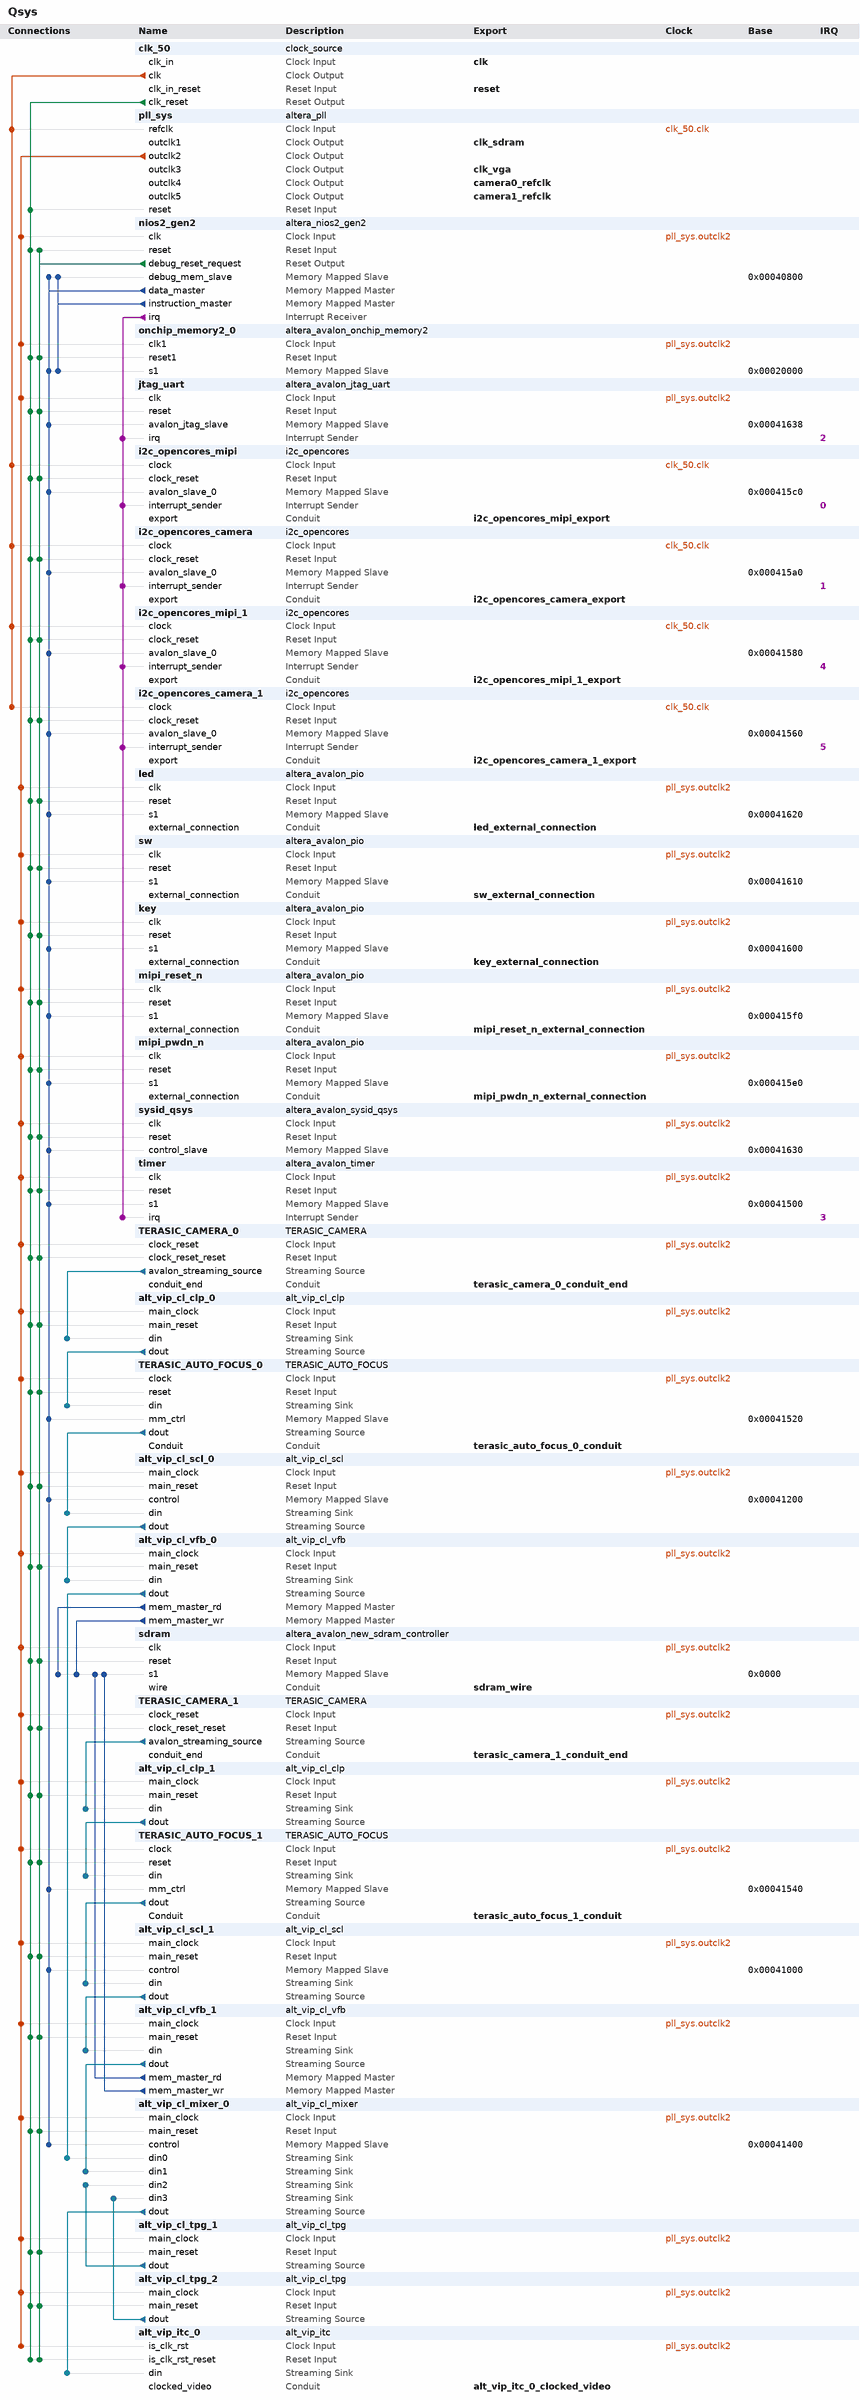
[diagram p0: system contents]
# Platform Designer (Qsys) system Qsys, Cyclone V 5CSEMA5F31C6
# Parameters at their usual value, and those the tool derives, are not listed.
package require -exact qsys 15.0
create_system Qsys
set_project_property DEVICE_FAMILY {Cyclone V}
set_project_property DEVICE 5CSEMA5F31C6

add_instance clk_50 clock_source 15.0
set_instance_parameter_value clk_50 clockFrequency 50000000

add_instance pll_sys altera_pll 15.0
set_instance_parameter_value pll_sys gui_device_speed_grade 2
set_instance_parameter_value pll_sys gui_number_of_clocks 6
set_instance_parameter_value pll_sys gui_operation_mode normal
set_instance_parameter_value pll_sys gui_output_clock_frequency0 100.0
set_instance_parameter_value pll_sys gui_output_clock_frequency1 100.0
set_instance_parameter_value pll_sys gui_output_clock_frequency2 100.0
set_instance_parameter_value pll_sys gui_output_clock_frequency3 40.0
set_instance_parameter_value pll_sys gui_phase_shift1 -3000
set_instance_parameter_value pll_sys gui_phase_shift_deg1 -90.0
set_instance_parameter_value pll_sys gui_pll_mode {Integer-N PLL}
set_instance_parameter_value pll_sys gui_reference_clock_frequency 50.0
set_instance_parameter_value pll_sys gui_use_locked false

add_instance nios2_gen2 altera_nios2_gen2 15.0
set_instance_parameter_value nios2_gen2 dcache_size 2048
set_instance_parameter_value nios2_gen2 exceptionSlave onchip_memory2_0.s1
set_instance_parameter_value nios2_gen2 icache_size 4096
set_instance_parameter_value nios2_gen2 impl Fast
set_instance_parameter_value nios2_gen2 resetSlave onchip_memory2_0.s1

add_instance onchip_memory2_0 altera_avalon_onchip_memory2 15.0
set_instance_parameter_value onchip_memory2_0 dataWidth 32
set_instance_parameter_value onchip_memory2_0 dualPort false
set_instance_parameter_value onchip_memory2_0 initMemContent false
set_instance_parameter_value onchip_memory2_0 initializationFileName onchip_mem.hex
set_instance_parameter_value onchip_memory2_0 memorySize 131072

add_instance jtag_uart altera_avalon_jtag_uart 15.0
set_instance_parameter_value jtag_uart simInteractiveOptions NO_INTERACTIVE_WINDOWS

add_instance i2c_opencores_mipi i2c_opencores 12.0

add_instance i2c_opencores_camera i2c_opencores 12.0

add_instance i2c_opencores_mipi_1 i2c_opencores 12.0

add_instance i2c_opencores_camera_1 i2c_opencores 12.0

add_instance led altera_avalon_pio 15.0
set_instance_parameter_value led direction Output
set_instance_parameter_value led width 10

add_instance sw altera_avalon_pio 15.0
set_instance_parameter_value sw direction Input
set_instance_parameter_value sw width 10

add_instance key altera_avalon_pio 15.0
set_instance_parameter_value key direction Input
set_instance_parameter_value key width 4

add_instance mipi_reset_n altera_avalon_pio 15.0
set_instance_parameter_value mipi_reset_n direction Output
set_instance_parameter_value mipi_reset_n width 1

add_instance mipi_pwdn_n altera_avalon_pio 15.0
set_instance_parameter_value mipi_pwdn_n direction Output
set_instance_parameter_value mipi_pwdn_n width 1

add_instance sysid_qsys altera_avalon_sysid_qsys 15.0
set_instance_parameter_value sysid_qsys id 0

add_instance timer altera_avalon_timer 15.0
set_instance_parameter_value timer period 1
set_instance_parameter_value timer periodUnits MSEC

add_instance TERASIC_CAMERA_0 TERASIC_CAMERA 1.0

add_instance alt_vip_cl_clp_0 alt_vip_cl_clp 15.0
set_instance_parameter_value alt_vip_cl_clp_0 BITS_PER_SYMBOL 8
set_instance_parameter_value alt_vip_cl_clp_0 BOTTOM_OFFSET 10
set_instance_parameter_value alt_vip_cl_clp_0 CLIPPING_METHOD RECTANGLE
set_instance_parameter_value alt_vip_cl_clp_0 COLOR_PLANES_ARE_IN_PARALLEL 1
set_instance_parameter_value alt_vip_cl_clp_0 FAMILY {Cyclone V}
set_instance_parameter_value alt_vip_cl_clp_0 LEFT_OFFSET 0
set_instance_parameter_value alt_vip_cl_clp_0 MAX_IN_HEIGHT 1080
set_instance_parameter_value alt_vip_cl_clp_0 MAX_IN_WIDTH 1920
set_instance_parameter_value alt_vip_cl_clp_0 NUMBER_OF_COLOR_PLANES 3
set_instance_parameter_value alt_vip_cl_clp_0 PIXELS_IN_PARALLEL 1
set_instance_parameter_value alt_vip_cl_clp_0 RECTANGLE_HEIGHT 480
set_instance_parameter_value alt_vip_cl_clp_0 RECTANGLE_WIDTH 640
set_instance_parameter_value alt_vip_cl_clp_0 RIGHT_OFFSET 10
set_instance_parameter_value alt_vip_cl_clp_0 RUNTIME_CONTROL 0
set_instance_parameter_value alt_vip_cl_clp_0 TOP_OFFSET 0

add_instance TERASIC_AUTO_FOCUS_0 TERASIC_AUTO_FOCUS 1.0

add_instance alt_vip_cl_scl_0 alt_vip_cl_scl 15.0
set_instance_parameter_value alt_vip_cl_scl_0 ALGORITHM_NAME POLYPHASE
set_instance_parameter_value alt_vip_cl_scl_0 ALWAYS_DOWNSCALE 0
set_instance_parameter_value alt_vip_cl_scl_0 ARE_IDENTICAL 0
set_instance_parameter_value alt_vip_cl_scl_0 BITS_PER_SYMBOL 8
set_instance_parameter_value alt_vip_cl_scl_0 DEFAULT_EDGE_THRESH 7
set_instance_parameter_value alt_vip_cl_scl_0 DEFAULT_LOWER_BLUR 0
set_instance_parameter_value alt_vip_cl_scl_0 DEFAULT_UPPER_BLUR 15
set_instance_parameter_value alt_vip_cl_scl_0 ENABLE_FIR 0
set_instance_parameter_value alt_vip_cl_scl_0 EXTRA_PIPELINING 0
set_instance_parameter_value alt_vip_cl_scl_0 FAMILY {Cyclone V}
set_instance_parameter_value alt_vip_cl_scl_0 H_BANKS 1
set_instance_parameter_value alt_vip_cl_scl_0 H_COEFF_FILE {<enter file name (including full path)>}
set_instance_parameter_value alt_vip_cl_scl_0 H_FRACTION_BITS 7
set_instance_parameter_value alt_vip_cl_scl_0 H_FUNCTION LANCZOS_2
set_instance_parameter_value alt_vip_cl_scl_0 H_INTEGER_BITS 1
set_instance_parameter_value alt_vip_cl_scl_0 H_PHASES 16
set_instance_parameter_value alt_vip_cl_scl_0 H_SIGNED 1
set_instance_parameter_value alt_vip_cl_scl_0 H_SYMMETRIC 0
set_instance_parameter_value alt_vip_cl_scl_0 H_TAPS 8
set_instance_parameter_value alt_vip_cl_scl_0 IS_420 0
set_instance_parameter_value alt_vip_cl_scl_0 IS_422 0
set_instance_parameter_value alt_vip_cl_scl_0 LOAD_AT_RUNTIME 0
set_instance_parameter_value alt_vip_cl_scl_0 MAX_IN_HEIGHT 480
set_instance_parameter_value alt_vip_cl_scl_0 MAX_IN_WIDTH 640
set_instance_parameter_value alt_vip_cl_scl_0 MAX_OUT_HEIGHT 480
set_instance_parameter_value alt_vip_cl_scl_0 MAX_OUT_WIDTH 640
set_instance_parameter_value alt_vip_cl_scl_0 NO_BLANKING 0
set_instance_parameter_value alt_vip_cl_scl_0 PRESERVE_BITS 0
set_instance_parameter_value alt_vip_cl_scl_0 RUNTIME_CONTROL 1
set_instance_parameter_value alt_vip_cl_scl_0 SYMBOLS_IN_PAR 3
set_instance_parameter_value alt_vip_cl_scl_0 SYMBOLS_IN_SEQ 1
set_instance_parameter_value alt_vip_cl_scl_0 V_BANKS 1
set_instance_parameter_value alt_vip_cl_scl_0 V_COEFF_FILE {<enter file name (including full path)>}
set_instance_parameter_value alt_vip_cl_scl_0 V_FRACTION_BITS 7
set_instance_parameter_value alt_vip_cl_scl_0 V_FUNCTION LANCZOS_2
set_instance_parameter_value alt_vip_cl_scl_0 V_INTEGER_BITS 1
set_instance_parameter_value alt_vip_cl_scl_0 V_PHASES 16
set_instance_parameter_value alt_vip_cl_scl_0 V_SIGNED 1
set_instance_parameter_value alt_vip_cl_scl_0 V_SYMMETRIC 0
set_instance_parameter_value alt_vip_cl_scl_0 V_TAPS 8

add_instance alt_vip_cl_vfb_0 alt_vip_cl_vfb 15.0
set_instance_parameter_value alt_vip_cl_vfb_0 CLOCKS_ARE_SEPARATE 0
set_instance_parameter_value alt_vip_cl_vfb_0 CORRECT_INVALID_FIELDS 0
set_instance_parameter_value alt_vip_cl_vfb_0 DROP_FRAMES 1
set_instance_parameter_value alt_vip_cl_vfb_0 IS_FRAME_READER 0
set_instance_parameter_value alt_vip_cl_vfb_0 MAX_HEIGHT 480
set_instance_parameter_value alt_vip_cl_vfb_0 MAX_WIDTH 640
set_instance_parameter_value alt_vip_cl_vfb_0 MEM_BASE_ADDR 0
set_instance_parameter_value alt_vip_cl_vfb_0 MEM_PORT_WIDTH 32
set_instance_parameter_value alt_vip_cl_vfb_0 READER_RUNTIME_CONTROL 0
set_instance_parameter_value alt_vip_cl_vfb_0 READ_FIFO_DEPTH 512
set_instance_parameter_value alt_vip_cl_vfb_0 USER_PACKETS_MAX_STORAGE 1
set_instance_parameter_value alt_vip_cl_vfb_0 WRITE_BURST_TARGET 32
set_instance_parameter_value alt_vip_cl_vfb_0 WRITE_FIFO_DEPTH 512

add_instance sdram altera_avalon_new_sdram_controller 15.0
set_instance_parameter_value sdram TAC 5.5
set_instance_parameter_value sdram TRCD 20.0
set_instance_parameter_value sdram TRP 20.0
set_instance_parameter_value sdram casLatency 3
set_instance_parameter_value sdram columnWidth 10
set_instance_parameter_value sdram dataWidth 16
set_instance_parameter_value sdram generateSimulationModel true
set_instance_parameter_value sdram model single_Micron_MT48LC4M32B2_7_chip
set_instance_parameter_value sdram numberOfBanks 4
set_instance_parameter_value sdram numberOfChipSelects 1
set_instance_parameter_value sdram powerUpDelay 100.0
set_instance_parameter_value sdram refreshPeriod 15.625
set_instance_parameter_value sdram rowWidth 13

add_instance TERASIC_CAMERA_1 TERASIC_CAMERA 1.0

add_instance alt_vip_cl_clp_1 alt_vip_cl_clp 15.0
set_instance_parameter_value alt_vip_cl_clp_1 BITS_PER_SYMBOL 8
set_instance_parameter_value alt_vip_cl_clp_1 BOTTOM_OFFSET 10
set_instance_parameter_value alt_vip_cl_clp_1 CLIPPING_METHOD RECTANGLE
set_instance_parameter_value alt_vip_cl_clp_1 COLOR_PLANES_ARE_IN_PARALLEL 1
set_instance_parameter_value alt_vip_cl_clp_1 FAMILY {Cyclone V}
set_instance_parameter_value alt_vip_cl_clp_1 LEFT_OFFSET 0
set_instance_parameter_value alt_vip_cl_clp_1 MAX_IN_HEIGHT 1080
set_instance_parameter_value alt_vip_cl_clp_1 MAX_IN_WIDTH 1920
set_instance_parameter_value alt_vip_cl_clp_1 NUMBER_OF_COLOR_PLANES 3
set_instance_parameter_value alt_vip_cl_clp_1 PIXELS_IN_PARALLEL 1
set_instance_parameter_value alt_vip_cl_clp_1 RECTANGLE_HEIGHT 480
set_instance_parameter_value alt_vip_cl_clp_1 RECTANGLE_WIDTH 640
set_instance_parameter_value alt_vip_cl_clp_1 RIGHT_OFFSET 10
set_instance_parameter_value alt_vip_cl_clp_1 RUNTIME_CONTROL 0
set_instance_parameter_value alt_vip_cl_clp_1 TOP_OFFSET 0

add_instance TERASIC_AUTO_FOCUS_1 TERASIC_AUTO_FOCUS 1.0

add_instance alt_vip_cl_scl_1 alt_vip_cl_scl 15.0
set_instance_parameter_value alt_vip_cl_scl_1 ALGORITHM_NAME POLYPHASE
set_instance_parameter_value alt_vip_cl_scl_1 ALWAYS_DOWNSCALE 0
set_instance_parameter_value alt_vip_cl_scl_1 ARE_IDENTICAL 0
set_instance_parameter_value alt_vip_cl_scl_1 BITS_PER_SYMBOL 8
set_instance_parameter_value alt_vip_cl_scl_1 DEFAULT_EDGE_THRESH 7
set_instance_parameter_value alt_vip_cl_scl_1 DEFAULT_LOWER_BLUR 0
set_instance_parameter_value alt_vip_cl_scl_1 DEFAULT_UPPER_BLUR 15
set_instance_parameter_value alt_vip_cl_scl_1 ENABLE_FIR 0
set_instance_parameter_value alt_vip_cl_scl_1 EXTRA_PIPELINING 0
set_instance_parameter_value alt_vip_cl_scl_1 FAMILY {Cyclone V}
set_instance_parameter_value alt_vip_cl_scl_1 H_BANKS 1
set_instance_parameter_value alt_vip_cl_scl_1 H_COEFF_FILE {<enter file name (including full path)>}
set_instance_parameter_value alt_vip_cl_scl_1 H_FRACTION_BITS 7
set_instance_parameter_value alt_vip_cl_scl_1 H_FUNCTION LANCZOS_2
set_instance_parameter_value alt_vip_cl_scl_1 H_INTEGER_BITS 1
set_instance_parameter_value alt_vip_cl_scl_1 H_PHASES 16
set_instance_parameter_value alt_vip_cl_scl_1 H_SIGNED 1
set_instance_parameter_value alt_vip_cl_scl_1 H_SYMMETRIC 0
set_instance_parameter_value alt_vip_cl_scl_1 H_TAPS 8
set_instance_parameter_value alt_vip_cl_scl_1 IS_420 0
set_instance_parameter_value alt_vip_cl_scl_1 IS_422 0
set_instance_parameter_value alt_vip_cl_scl_1 LOAD_AT_RUNTIME 0
set_instance_parameter_value alt_vip_cl_scl_1 MAX_IN_HEIGHT 480
set_instance_parameter_value alt_vip_cl_scl_1 MAX_IN_WIDTH 640
set_instance_parameter_value alt_vip_cl_scl_1 MAX_OUT_HEIGHT 480
set_instance_parameter_value alt_vip_cl_scl_1 MAX_OUT_WIDTH 640
set_instance_parameter_value alt_vip_cl_scl_1 NO_BLANKING 0
set_instance_parameter_value alt_vip_cl_scl_1 PRESERVE_BITS 0
set_instance_parameter_value alt_vip_cl_scl_1 RUNTIME_CONTROL 1
set_instance_parameter_value alt_vip_cl_scl_1 SYMBOLS_IN_PAR 3
set_instance_parameter_value alt_vip_cl_scl_1 SYMBOLS_IN_SEQ 1
set_instance_parameter_value alt_vip_cl_scl_1 V_BANKS 1
set_instance_parameter_value alt_vip_cl_scl_1 V_COEFF_FILE {<enter file name (including full path)>}
set_instance_parameter_value alt_vip_cl_scl_1 V_FRACTION_BITS 7
set_instance_parameter_value alt_vip_cl_scl_1 V_FUNCTION LANCZOS_2
set_instance_parameter_value alt_vip_cl_scl_1 V_INTEGER_BITS 1
set_instance_parameter_value alt_vip_cl_scl_1 V_PHASES 16
set_instance_parameter_value alt_vip_cl_scl_1 V_SIGNED 1
set_instance_parameter_value alt_vip_cl_scl_1 V_SYMMETRIC 0
set_instance_parameter_value alt_vip_cl_scl_1 V_TAPS 8

add_instance alt_vip_cl_vfb_1 alt_vip_cl_vfb 15.0
set_instance_parameter_value alt_vip_cl_vfb_1 CLOCKS_ARE_SEPARATE 0
set_instance_parameter_value alt_vip_cl_vfb_1 CORRECT_INVALID_FIELDS 0
set_instance_parameter_value alt_vip_cl_vfb_1 DROP_FRAMES 1
set_instance_parameter_value alt_vip_cl_vfb_1 IS_FRAME_READER 0
set_instance_parameter_value alt_vip_cl_vfb_1 MAX_HEIGHT 480
set_instance_parameter_value alt_vip_cl_vfb_1 MAX_WIDTH 640
set_instance_parameter_value alt_vip_cl_vfb_1 MEM_BASE_ADDR 33554432
set_instance_parameter_value alt_vip_cl_vfb_1 MEM_PORT_WIDTH 32
set_instance_parameter_value alt_vip_cl_vfb_1 READER_RUNTIME_CONTROL 0
set_instance_parameter_value alt_vip_cl_vfb_1 READ_FIFO_DEPTH 512
set_instance_parameter_value alt_vip_cl_vfb_1 USER_PACKETS_MAX_STORAGE 1
set_instance_parameter_value alt_vip_cl_vfb_1 WRITE_BURST_TARGET 32
set_instance_parameter_value alt_vip_cl_vfb_1 WRITE_FIFO_DEPTH 512

add_instance alt_vip_cl_mixer_0 alt_vip_cl_mixer 15.0
set_instance_parameter_value alt_vip_cl_mixer_0 BITS_PER_SYMBOL 8
set_instance_parameter_value alt_vip_cl_mixer_0 COLOR_PLANES_ARE_IN_PARALLEL 1
set_instance_parameter_value alt_vip_cl_mixer_0 COLOR_SPACE RGB
set_instance_parameter_value alt_vip_cl_mixer_0 FAMILY {Cyclone V}
set_instance_parameter_value alt_vip_cl_mixer_0 MAX_HEIGHT 600
set_instance_parameter_value alt_vip_cl_mixer_0 MAX_WIDTH 800
set_instance_parameter_value alt_vip_cl_mixer_0 NUMBER_OF_COLOR_PLANES 3
set_instance_parameter_value alt_vip_cl_mixer_0 OUTPUT_FORMAT 4.4.4
set_instance_parameter_value alt_vip_cl_mixer_0 PATTERN uniform
set_instance_parameter_value alt_vip_cl_mixer_0 PIXELS_IN_PARALLEL 1
set_instance_parameter_value alt_vip_cl_mixer_0 RUNTIME_CONTROL 1
set_instance_parameter_value alt_vip_cl_mixer_0 UNIFORM_VALUE_BCR 210
set_instance_parameter_value alt_vip_cl_mixer_0 UNIFORM_VALUE_GCB 170
set_instance_parameter_value alt_vip_cl_mixer_0 UNIFORM_VALUE_RY 16

add_instance alt_vip_cl_tpg_1 alt_vip_cl_tpg 15.0
set_instance_parameter_value alt_vip_cl_tpg_1 BPS 8
set_instance_parameter_value alt_vip_cl_tpg_1 COLOR_PLANES_ARE_IN_PARALLEL 1
set_instance_parameter_value alt_vip_cl_tpg_1 COLOR_SPACE RGB
set_instance_parameter_value alt_vip_cl_tpg_1 FAMILY {Cyclone V}
set_instance_parameter_value alt_vip_cl_tpg_1 INTERLACING prog
set_instance_parameter_value alt_vip_cl_tpg_1 MAX_HEIGHT 100
set_instance_parameter_value alt_vip_cl_tpg_1 MAX_WIDTH 100
set_instance_parameter_value alt_vip_cl_tpg_1 OUTPUT_FORMAT 4.4.4
set_instance_parameter_value alt_vip_cl_tpg_1 PATTERN colorbars
set_instance_parameter_value alt_vip_cl_tpg_1 PIXELS_IN_PARALLEL 1
set_instance_parameter_value alt_vip_cl_tpg_1 RUNTIME_CONTROL 0
set_instance_parameter_value alt_vip_cl_tpg_1 UNIFORM_VALUE_BCR 16
set_instance_parameter_value alt_vip_cl_tpg_1 UNIFORM_VALUE_GCB 16
set_instance_parameter_value alt_vip_cl_tpg_1 UNIFORM_VALUE_RY 16

add_instance alt_vip_cl_tpg_2 alt_vip_cl_tpg 15.0
set_instance_parameter_value alt_vip_cl_tpg_2 BPS 8
set_instance_parameter_value alt_vip_cl_tpg_2 COLOR_PLANES_ARE_IN_PARALLEL 1
set_instance_parameter_value alt_vip_cl_tpg_2 COLOR_SPACE RGB
set_instance_parameter_value alt_vip_cl_tpg_2 FAMILY {Cyclone V}
set_instance_parameter_value alt_vip_cl_tpg_2 INTERLACING prog
set_instance_parameter_value alt_vip_cl_tpg_2 MAX_HEIGHT 160
set_instance_parameter_value alt_vip_cl_tpg_2 MAX_WIDTH 160
set_instance_parameter_value alt_vip_cl_tpg_2 OUTPUT_FORMAT 4.4.4
set_instance_parameter_value alt_vip_cl_tpg_2 PATTERN greyscalebars
set_instance_parameter_value alt_vip_cl_tpg_2 PIXELS_IN_PARALLEL 1
set_instance_parameter_value alt_vip_cl_tpg_2 RUNTIME_CONTROL 0
set_instance_parameter_value alt_vip_cl_tpg_2 UNIFORM_VALUE_BCR 16
set_instance_parameter_value alt_vip_cl_tpg_2 UNIFORM_VALUE_GCB 16
set_instance_parameter_value alt_vip_cl_tpg_2 UNIFORM_VALUE_RY 16

add_instance alt_vip_itc_0 alt_vip_itc 14.0
set_instance_parameter_value alt_vip_itc_0 FIFO_DEPTH 2000
set_instance_parameter_value alt_vip_itc_0 H_ACTIVE_PIXELS 800
set_instance_parameter_value alt_vip_itc_0 H_BACK_PORCH 88
set_instance_parameter_value alt_vip_itc_0 H_FRONT_PORCH 40
set_instance_parameter_value alt_vip_itc_0 H_SYNC_LENGTH 128
set_instance_parameter_value alt_vip_itc_0 NUMBER_OF_COLOUR_PLANES 3
set_instance_parameter_value alt_vip_itc_0 THRESHOLD 799
set_instance_parameter_value alt_vip_itc_0 V_ACTIVE_LINES 600
set_instance_parameter_value alt_vip_itc_0 V_BACK_PORCH 23
set_instance_parameter_value alt_vip_itc_0 V_FRONT_PORCH 1
set_instance_parameter_value alt_vip_itc_0 V_SYNC_LENGTH 4

# connections
add_connection clk_50.clk i2c_opencores_camera.clock clock
add_connection clk_50.clk i2c_opencores_camera_1.clock clock
add_connection clk_50.clk i2c_opencores_mipi.clock clock
add_connection clk_50.clk i2c_opencores_mipi_1.clock clock
add_connection clk_50.clk pll_sys.refclk clock
add_connection pll_sys.outclk2 alt_vip_cl_clp_0.main_clock clock
add_connection pll_sys.outclk2 alt_vip_cl_clp_1.main_clock clock
add_connection pll_sys.outclk2 alt_vip_cl_mixer_0.main_clock clock
add_connection pll_sys.outclk2 alt_vip_cl_scl_0.main_clock clock
add_connection pll_sys.outclk2 alt_vip_cl_scl_1.main_clock clock
add_connection pll_sys.outclk2 alt_vip_cl_tpg_1.main_clock clock
add_connection pll_sys.outclk2 alt_vip_cl_tpg_2.main_clock clock
add_connection pll_sys.outclk2 alt_vip_cl_vfb_0.main_clock clock
add_connection pll_sys.outclk2 alt_vip_cl_vfb_1.main_clock clock
add_connection pll_sys.outclk2 alt_vip_itc_0.is_clk_rst clock
add_connection pll_sys.outclk2 jtag_uart.clk clock
add_connection pll_sys.outclk2 key.clk clock
add_connection pll_sys.outclk2 led.clk clock
add_connection pll_sys.outclk2 mipi_pwdn_n.clk clock
add_connection pll_sys.outclk2 mipi_reset_n.clk clock
add_connection pll_sys.outclk2 nios2_gen2.clk clock
add_connection pll_sys.outclk2 onchip_memory2_0.clk1 clock
add_connection pll_sys.outclk2 sdram.clk clock
add_connection pll_sys.outclk2 sw.clk clock
add_connection pll_sys.outclk2 sysid_qsys.clk clock
add_connection pll_sys.outclk2 TERASIC_AUTO_FOCUS_0.clock clock
add_connection pll_sys.outclk2 TERASIC_AUTO_FOCUS_1.clock clock
add_connection pll_sys.outclk2 TERASIC_CAMERA_0.clock_reset clock
add_connection pll_sys.outclk2 TERASIC_CAMERA_1.clock_reset clock
add_connection pll_sys.outclk2 timer.clk clock
add_connection clk_50.clk_reset alt_vip_cl_clp_0.main_reset reset
add_connection clk_50.clk_reset alt_vip_cl_clp_1.main_reset reset
add_connection clk_50.clk_reset alt_vip_cl_mixer_0.main_reset reset
add_connection clk_50.clk_reset alt_vip_cl_scl_0.main_reset reset
add_connection clk_50.clk_reset alt_vip_cl_scl_1.main_reset reset
add_connection clk_50.clk_reset alt_vip_cl_tpg_1.main_reset reset
add_connection clk_50.clk_reset alt_vip_cl_tpg_2.main_reset reset
add_connection clk_50.clk_reset alt_vip_cl_vfb_0.main_reset reset
add_connection clk_50.clk_reset alt_vip_cl_vfb_1.main_reset reset
add_connection clk_50.clk_reset alt_vip_itc_0.is_clk_rst_reset reset
add_connection clk_50.clk_reset i2c_opencores_camera.clock_reset reset
add_connection clk_50.clk_reset i2c_opencores_camera_1.clock_reset reset
add_connection clk_50.clk_reset i2c_opencores_mipi.clock_reset reset
add_connection clk_50.clk_reset i2c_opencores_mipi_1.clock_reset reset
add_connection clk_50.clk_reset jtag_uart.reset reset
add_connection clk_50.clk_reset key.reset reset
add_connection clk_50.clk_reset led.reset reset
add_connection clk_50.clk_reset mipi_pwdn_n.reset reset
add_connection clk_50.clk_reset mipi_reset_n.reset reset
add_connection clk_50.clk_reset nios2_gen2.reset reset
add_connection clk_50.clk_reset onchip_memory2_0.reset1 reset
add_connection clk_50.clk_reset pll_sys.reset reset
add_connection clk_50.clk_reset sdram.reset reset
add_connection clk_50.clk_reset sw.reset reset
add_connection clk_50.clk_reset sysid_qsys.reset reset
add_connection clk_50.clk_reset TERASIC_AUTO_FOCUS_0.reset reset
add_connection clk_50.clk_reset TERASIC_AUTO_FOCUS_1.reset reset
add_connection clk_50.clk_reset TERASIC_CAMERA_0.clock_reset_reset reset
add_connection clk_50.clk_reset TERASIC_CAMERA_1.clock_reset_reset reset
add_connection clk_50.clk_reset timer.reset reset
add_connection nios2_gen2.debug_reset_request alt_vip_cl_clp_0.main_reset reset
add_connection nios2_gen2.debug_reset_request alt_vip_cl_clp_1.main_reset reset
add_connection nios2_gen2.debug_reset_request alt_vip_cl_mixer_0.main_reset reset
add_connection nios2_gen2.debug_reset_request alt_vip_cl_scl_0.main_reset reset
add_connection nios2_gen2.debug_reset_request alt_vip_cl_scl_1.main_reset reset
add_connection nios2_gen2.debug_reset_request alt_vip_cl_tpg_1.main_reset reset
add_connection nios2_gen2.debug_reset_request alt_vip_cl_tpg_2.main_reset reset
add_connection nios2_gen2.debug_reset_request alt_vip_cl_vfb_0.main_reset reset
add_connection nios2_gen2.debug_reset_request alt_vip_cl_vfb_1.main_reset reset
add_connection nios2_gen2.debug_reset_request alt_vip_itc_0.is_clk_rst_reset reset
add_connection nios2_gen2.debug_reset_request i2c_opencores_camera.clock_reset reset
add_connection nios2_gen2.debug_reset_request i2c_opencores_camera_1.clock_reset reset
add_connection nios2_gen2.debug_reset_request i2c_opencores_mipi.clock_reset reset
add_connection nios2_gen2.debug_reset_request i2c_opencores_mipi_1.clock_reset reset
add_connection nios2_gen2.debug_reset_request jtag_uart.reset reset
add_connection nios2_gen2.debug_reset_request key.reset reset
add_connection nios2_gen2.debug_reset_request led.reset reset
add_connection nios2_gen2.debug_reset_request mipi_pwdn_n.reset reset
add_connection nios2_gen2.debug_reset_request mipi_reset_n.reset reset
add_connection nios2_gen2.debug_reset_request nios2_gen2.reset reset
add_connection nios2_gen2.debug_reset_request onchip_memory2_0.reset1 reset
add_connection nios2_gen2.debug_reset_request sdram.reset reset
add_connection nios2_gen2.debug_reset_request sw.reset reset
add_connection nios2_gen2.debug_reset_request sysid_qsys.reset reset
add_connection nios2_gen2.debug_reset_request TERASIC_AUTO_FOCUS_0.reset reset
add_connection nios2_gen2.debug_reset_request TERASIC_AUTO_FOCUS_1.reset reset
add_connection nios2_gen2.debug_reset_request TERASIC_CAMERA_0.clock_reset_reset reset
add_connection nios2_gen2.debug_reset_request TERASIC_CAMERA_1.clock_reset_reset reset
add_connection nios2_gen2.debug_reset_request timer.reset reset
add_connection alt_vip_cl_vfb_0.mem_master_rd sdram.s1 avalon
set_connection_parameter_value alt_vip_cl_vfb_0.mem_master_rd/sdram.s1 baseAddress 0x0000
add_connection alt_vip_cl_vfb_0.mem_master_wr sdram.s1 avalon
set_connection_parameter_value alt_vip_cl_vfb_0.mem_master_wr/sdram.s1 baseAddress 0x0000
add_connection alt_vip_cl_vfb_1.mem_master_rd sdram.s1 avalon
set_connection_parameter_value alt_vip_cl_vfb_1.mem_master_rd/sdram.s1 baseAddress 0x0000
add_connection alt_vip_cl_vfb_1.mem_master_wr sdram.s1 avalon
set_connection_parameter_value alt_vip_cl_vfb_1.mem_master_wr/sdram.s1 baseAddress 0x0000
add_connection nios2_gen2.data_master alt_vip_cl_mixer_0.control avalon
set_connection_parameter_value nios2_gen2.data_master/alt_vip_cl_mixer_0.control baseAddress 0x00041400
add_connection nios2_gen2.data_master alt_vip_cl_scl_0.control avalon
set_connection_parameter_value nios2_gen2.data_master/alt_vip_cl_scl_0.control baseAddress 0x00041200
add_connection nios2_gen2.data_master alt_vip_cl_scl_1.control avalon
set_connection_parameter_value nios2_gen2.data_master/alt_vip_cl_scl_1.control baseAddress 0x00041000
add_connection nios2_gen2.data_master i2c_opencores_camera.avalon_slave_0 avalon
set_connection_parameter_value nios2_gen2.data_master/i2c_opencores_camera.avalon_slave_0 baseAddress 0x000415a0
add_connection nios2_gen2.data_master i2c_opencores_camera_1.avalon_slave_0 avalon
set_connection_parameter_value nios2_gen2.data_master/i2c_opencores_camera_1.avalon_slave_0 baseAddress 0x00041560
add_connection nios2_gen2.data_master i2c_opencores_mipi.avalon_slave_0 avalon
set_connection_parameter_value nios2_gen2.data_master/i2c_opencores_mipi.avalon_slave_0 baseAddress 0x000415c0
add_connection nios2_gen2.data_master i2c_opencores_mipi_1.avalon_slave_0 avalon
set_connection_parameter_value nios2_gen2.data_master/i2c_opencores_mipi_1.avalon_slave_0 baseAddress 0x00041580
add_connection nios2_gen2.data_master jtag_uart.avalon_jtag_slave avalon
set_connection_parameter_value nios2_gen2.data_master/jtag_uart.avalon_jtag_slave baseAddress 0x00041638
add_connection nios2_gen2.data_master key.s1 avalon
set_connection_parameter_value nios2_gen2.data_master/key.s1 baseAddress 0x00041600
add_connection nios2_gen2.data_master led.s1 avalon
set_connection_parameter_value nios2_gen2.data_master/led.s1 baseAddress 0x00041620
add_connection nios2_gen2.data_master mipi_pwdn_n.s1 avalon
set_connection_parameter_value nios2_gen2.data_master/mipi_pwdn_n.s1 baseAddress 0x000415e0
add_connection nios2_gen2.data_master mipi_reset_n.s1 avalon
set_connection_parameter_value nios2_gen2.data_master/mipi_reset_n.s1 baseAddress 0x000415f0
add_connection nios2_gen2.data_master nios2_gen2.debug_mem_slave avalon
set_connection_parameter_value nios2_gen2.data_master/nios2_gen2.debug_mem_slave baseAddress 0x00040800
add_connection nios2_gen2.data_master onchip_memory2_0.s1 avalon
set_connection_parameter_value nios2_gen2.data_master/onchip_memory2_0.s1 baseAddress 0x00020000
add_connection nios2_gen2.data_master sw.s1 avalon
set_connection_parameter_value nios2_gen2.data_master/sw.s1 baseAddress 0x00041610
add_connection nios2_gen2.data_master sysid_qsys.control_slave avalon
set_connection_parameter_value nios2_gen2.data_master/sysid_qsys.control_slave baseAddress 0x00041630
add_connection nios2_gen2.data_master TERASIC_AUTO_FOCUS_0.mm_ctrl avalon
set_connection_parameter_value nios2_gen2.data_master/TERASIC_AUTO_FOCUS_0.mm_ctrl baseAddress 0x00041520
add_connection nios2_gen2.data_master TERASIC_AUTO_FOCUS_1.mm_ctrl avalon
set_connection_parameter_value nios2_gen2.data_master/TERASIC_AUTO_FOCUS_1.mm_ctrl baseAddress 0x00041540
add_connection nios2_gen2.data_master timer.s1 avalon
set_connection_parameter_value nios2_gen2.data_master/timer.s1 baseAddress 0x00041500
add_connection nios2_gen2.instruction_master nios2_gen2.debug_mem_slave avalon
set_connection_parameter_value nios2_gen2.instruction_master/nios2_gen2.debug_mem_slave baseAddress 0x00040800
add_connection nios2_gen2.instruction_master onchip_memory2_0.s1 avalon
set_connection_parameter_value nios2_gen2.instruction_master/onchip_memory2_0.s1 baseAddress 0x00020000
add_connection alt_vip_cl_clp_0.dout TERASIC_AUTO_FOCUS_0.din avalon_streaming
add_connection alt_vip_cl_clp_1.dout TERASIC_AUTO_FOCUS_1.din avalon_streaming
add_connection alt_vip_cl_mixer_0.dout alt_vip_itc_0.din avalon_streaming
add_connection alt_vip_cl_scl_0.dout alt_vip_cl_vfb_0.din avalon_streaming
add_connection alt_vip_cl_scl_1.dout alt_vip_cl_vfb_1.din avalon_streaming
add_connection alt_vip_cl_tpg_1.dout alt_vip_cl_mixer_0.din2 avalon_streaming
add_connection alt_vip_cl_tpg_2.dout alt_vip_cl_mixer_0.din3 avalon_streaming
add_connection alt_vip_cl_vfb_0.dout alt_vip_cl_mixer_0.din0 avalon_streaming
add_connection alt_vip_cl_vfb_1.dout alt_vip_cl_mixer_0.din1 avalon_streaming
add_connection TERASIC_AUTO_FOCUS_0.dout alt_vip_cl_scl_0.din avalon_streaming
add_connection TERASIC_AUTO_FOCUS_1.dout alt_vip_cl_scl_1.din avalon_streaming
add_connection TERASIC_CAMERA_0.avalon_streaming_source alt_vip_cl_clp_0.din avalon_streaming
add_connection TERASIC_CAMERA_1.avalon_streaming_source alt_vip_cl_clp_1.din avalon_streaming
add_connection nios2_gen2.irq i2c_opencores_camera.interrupt_sender interrupt
set_connection_parameter_value nios2_gen2.irq/i2c_opencores_camera.interrupt_sender irqNumber 1
add_connection nios2_gen2.irq i2c_opencores_camera_1.interrupt_sender interrupt
set_connection_parameter_value nios2_gen2.irq/i2c_opencores_camera_1.interrupt_sender irqNumber 5
add_connection nios2_gen2.irq i2c_opencores_mipi.interrupt_sender interrupt
set_connection_parameter_value nios2_gen2.irq/i2c_opencores_mipi.interrupt_sender irqNumber 0
add_connection nios2_gen2.irq i2c_opencores_mipi_1.interrupt_sender interrupt
set_connection_parameter_value nios2_gen2.irq/i2c_opencores_mipi_1.interrupt_sender irqNumber 4
add_connection nios2_gen2.irq jtag_uart.irq interrupt
set_connection_parameter_value nios2_gen2.irq/jtag_uart.irq irqNumber 2
add_connection nios2_gen2.irq timer.irq interrupt
set_connection_parameter_value nios2_gen2.irq/timer.irq irqNumber 3

# exported interfaces
add_interface alt_vip_itc_0_clocked_video conduit end
set_interface_property alt_vip_itc_0_clocked_video EXPORT_OF alt_vip_itc_0.clocked_video
add_interface camera0_refclk clock source
set_interface_property camera0_refclk EXPORT_OF pll_sys.outclk4
add_interface camera1_refclk clock source
set_interface_property camera1_refclk EXPORT_OF pll_sys.outclk5
add_interface clk clock sink
set_interface_property clk EXPORT_OF clk_50.clk_in
add_interface clk_sdram clock source
set_interface_property clk_sdram EXPORT_OF pll_sys.outclk1
add_interface clk_vga clock source
set_interface_property clk_vga EXPORT_OF pll_sys.outclk3
add_interface i2c_opencores_camera_1_export conduit end
set_interface_property i2c_opencores_camera_1_export EXPORT_OF i2c_opencores_camera_1.export
add_interface i2c_opencores_camera_export conduit end
set_interface_property i2c_opencores_camera_export EXPORT_OF i2c_opencores_camera.export
add_interface i2c_opencores_mipi_1_export conduit end
set_interface_property i2c_opencores_mipi_1_export EXPORT_OF i2c_opencores_mipi_1.export
add_interface i2c_opencores_mipi_export conduit end
set_interface_property i2c_opencores_mipi_export EXPORT_OF i2c_opencores_mipi.export
add_interface key_external_connection conduit end
set_interface_property key_external_connection EXPORT_OF key.external_connection
add_interface led_external_connection conduit end
set_interface_property led_external_connection EXPORT_OF led.external_connection
add_interface mipi_pwdn_n_external_connection conduit end
set_interface_property mipi_pwdn_n_external_connection EXPORT_OF mipi_pwdn_n.external_connection
add_interface mipi_reset_n_external_connection conduit end
set_interface_property mipi_reset_n_external_connection EXPORT_OF mipi_reset_n.external_connection
add_interface reset reset sink
set_interface_property reset EXPORT_OF clk_50.clk_in_reset
add_interface sdram_wire conduit end
set_interface_property sdram_wire EXPORT_OF sdram.wire
add_interface sw_external_connection conduit end
set_interface_property sw_external_connection EXPORT_OF sw.external_connection
add_interface terasic_auto_focus_0_conduit conduit end
set_interface_property terasic_auto_focus_0_conduit EXPORT_OF TERASIC_AUTO_FOCUS_0.Conduit
add_interface terasic_auto_focus_1_conduit conduit end
set_interface_property terasic_auto_focus_1_conduit EXPORT_OF TERASIC_AUTO_FOCUS_1.Conduit
add_interface terasic_camera_0_conduit_end conduit end
set_interface_property terasic_camera_0_conduit_end EXPORT_OF TERASIC_CAMERA_0.conduit_end
add_interface terasic_camera_1_conduit_end conduit end
set_interface_property terasic_camera_1_conduit_end EXPORT_OF TERASIC_CAMERA_1.conduit_end

set_interconnect_requirement {$system} qsys_mm.clockCrossingAdapter HANDSHAKE
set_interconnect_requirement {$system} qsys_mm.enableEccProtection FALSE
set_interconnect_requirement {$system} qsys_mm.insertDefaultSlave FALSE
set_interconnect_requirement {$system} qsys_mm.maxAdditionalLatency 1

save_system Qsys.qsys
